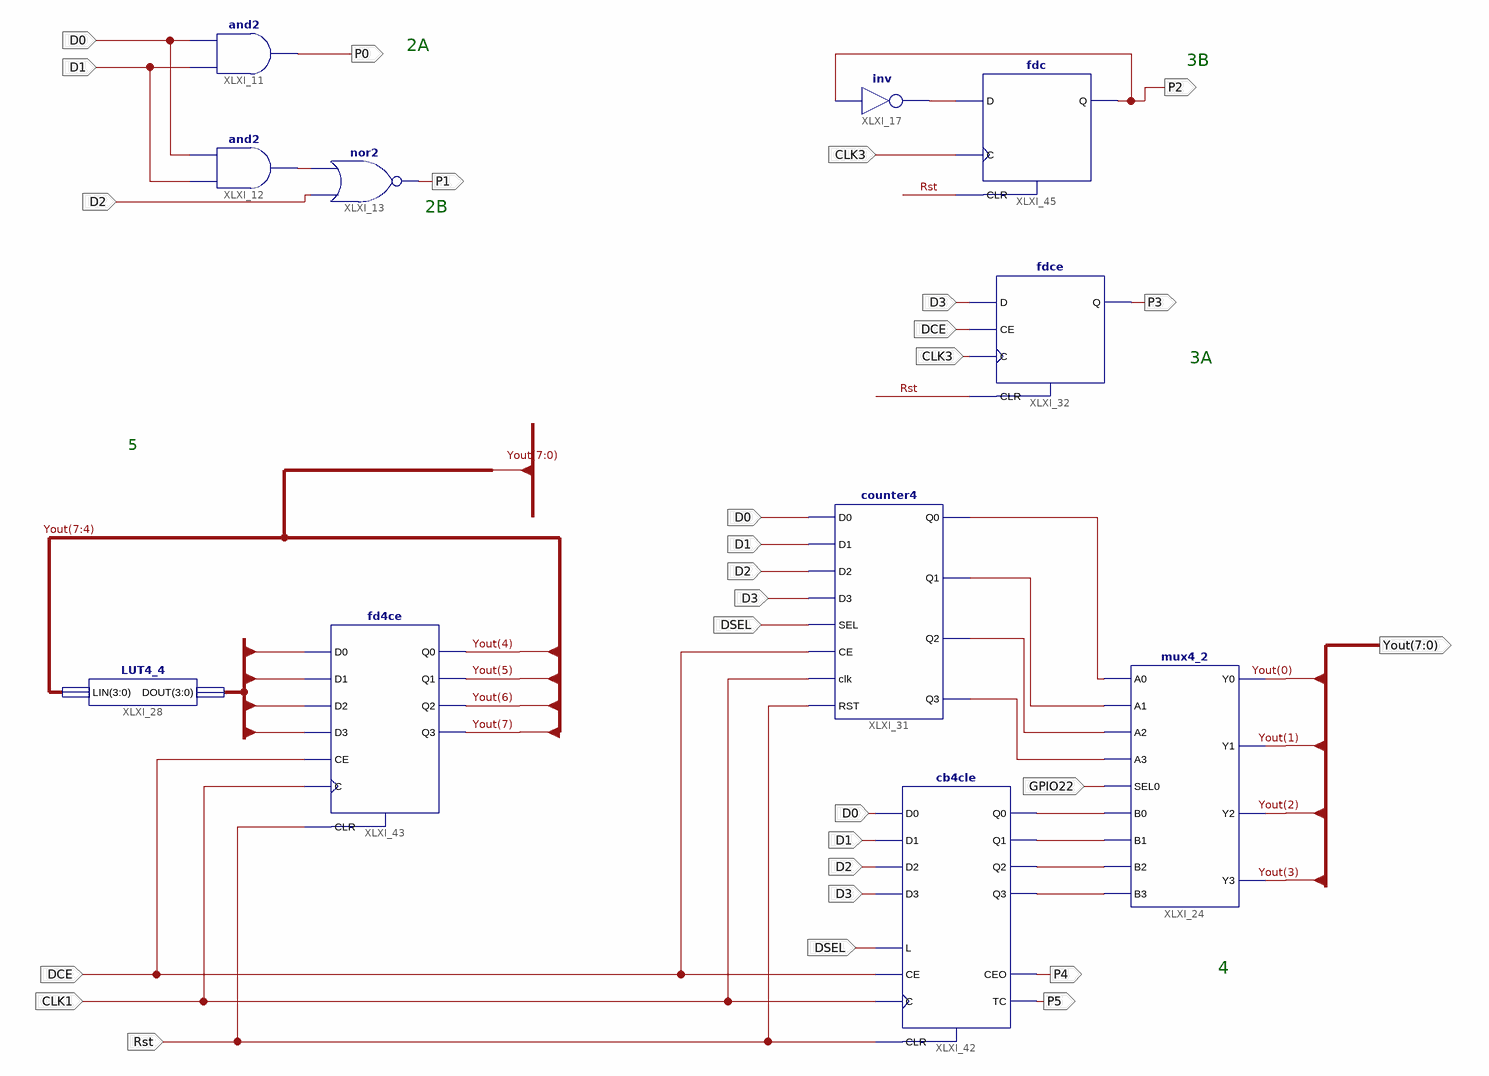
[diagram p0: schematic sheet 1]
// Xilinx ISE schematic digpr1.sch (spartan6) as structural Verilog: 11 symbols, 17 ports
module digpr1 (
  input  D2,
  input  D0,
  input  D1,
  input  D3,
  input  DCE,
  input  Rst,
  input  CLK1,
  input  GPIO22,
  input  CLK3,
  input  DSEL,
  output P0,
  output P1,
  output P3,
  output [7:0] Yout,
  output P4,
  output P5,
  output P2
);

  wire XLXN_18, XLXN_58, XLXN_240, XLXN_241, XLXN_242, XLXN_299, XLXN_300, XLXN_301, XLXN_302, XLXN_309;
  wire [3:0] DIN;

  and XLXI_11 (P0, D1, D0);
  and XLXI_12 (XLXN_18, D1, D0);
  nor XLXI_13 (P1, D2, XLXN_18);
  not XLXI_17 (XLXN_309, P2);
  mux4_2 XLXI_24 (
    .A0(XLXN_58), .SEL0(GPIO22), .B3(XLXN_302), .Y0(Yout[0]), .Y1(Yout[1]), .Y2(Yout[2]), .Y3(Yout[3]),
    .A1(XLXN_242), .A2(XLXN_241), .B0(XLXN_299), .A3(XLXN_240), .B2(XLXN_301), .B1(XLXN_300));
  LUT4_4 XLXI_28 (.LIN(Yout[7:4]), .DOUT(DIN));
  fdce XLXI_32 (.C(CLK3), .CE(DCE), .CLR(Rst), .D(D3), .Q(P3));
  counter4 XLXI_31 (
    .Q1(XLXN_242), .Q3(XLXN_240), .RST(Rst), .clk(CLK1), .CE(DCE), .D0(D0), .D1(D1), .D3(D3), .D2(D2),
    .SEL(DSEL), .Q2(XLXN_241), .Q0(XLXN_58));
  cb4cle XLXI_42 (
    .C(CLK1), .CE(DCE), .CLR(Rst), .D0(D0), .D1(D1), .D2(D2), .D3(D3), .L(DSEL), .CEO(P4), .Q0(XLXN_299),
    .Q1(XLXN_300), .Q2(XLXN_301), .Q3(XLXN_302), .TC(P5));
  fd4ce XLXI_43 (
    .C(CLK1), .CE(DCE), .CLR(Rst), .D0(DIN[0]), .D1(DIN[1]), .D2(DIN[2]), .D3(DIN[3]), .Q0(Yout[4]),
    .Q1(Yout[5]), .Q2(Yout[6]), .Q3(Yout[7]));
  fdc XLXI_45 (.C(CLK3), .CLR(Rst), .D(XLXN_309), .Q(P2));

  // Notes on the sheet:
  //   2A
  //   3B
  //   2B
  //   3A
  //   5
  //   4
endmodule
